# EAGLE schematic 32u4 denemesi (EAGLE 7.4.0)
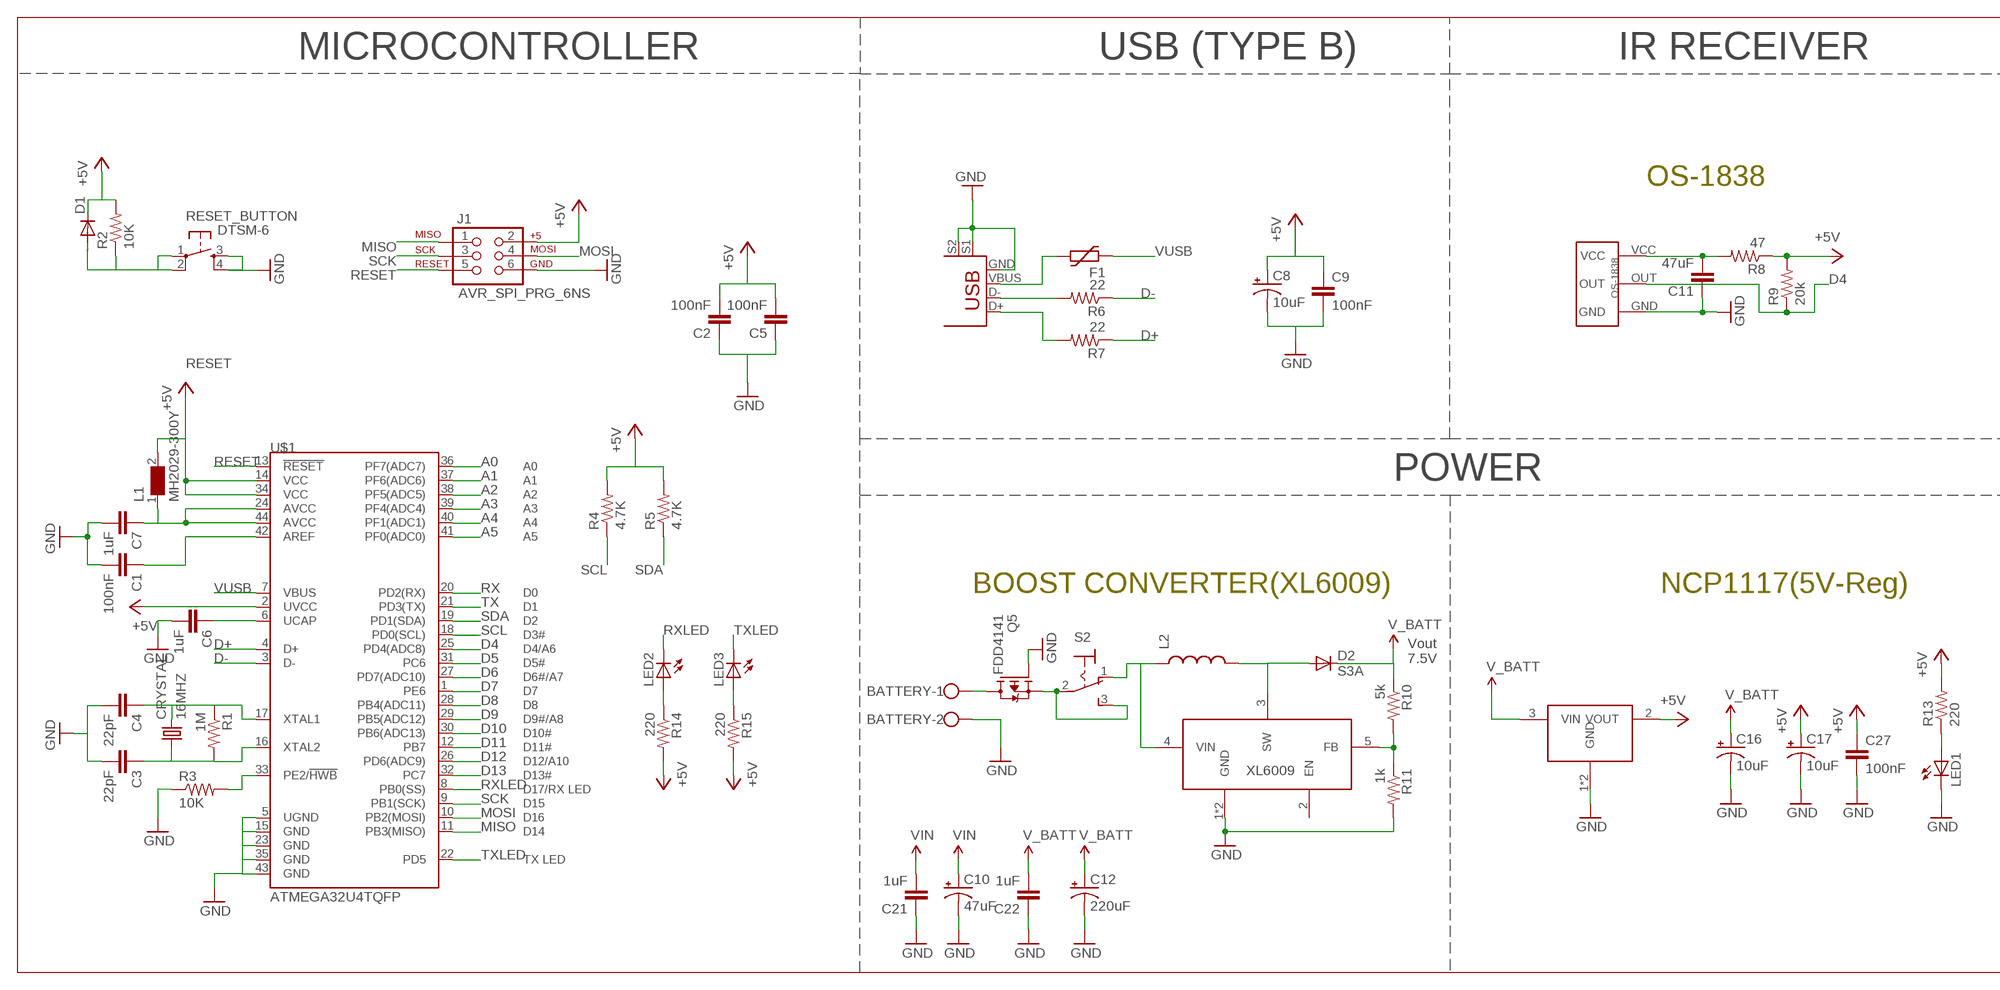
[diagram p0: schematic, sheet 1, part 1 of 2]
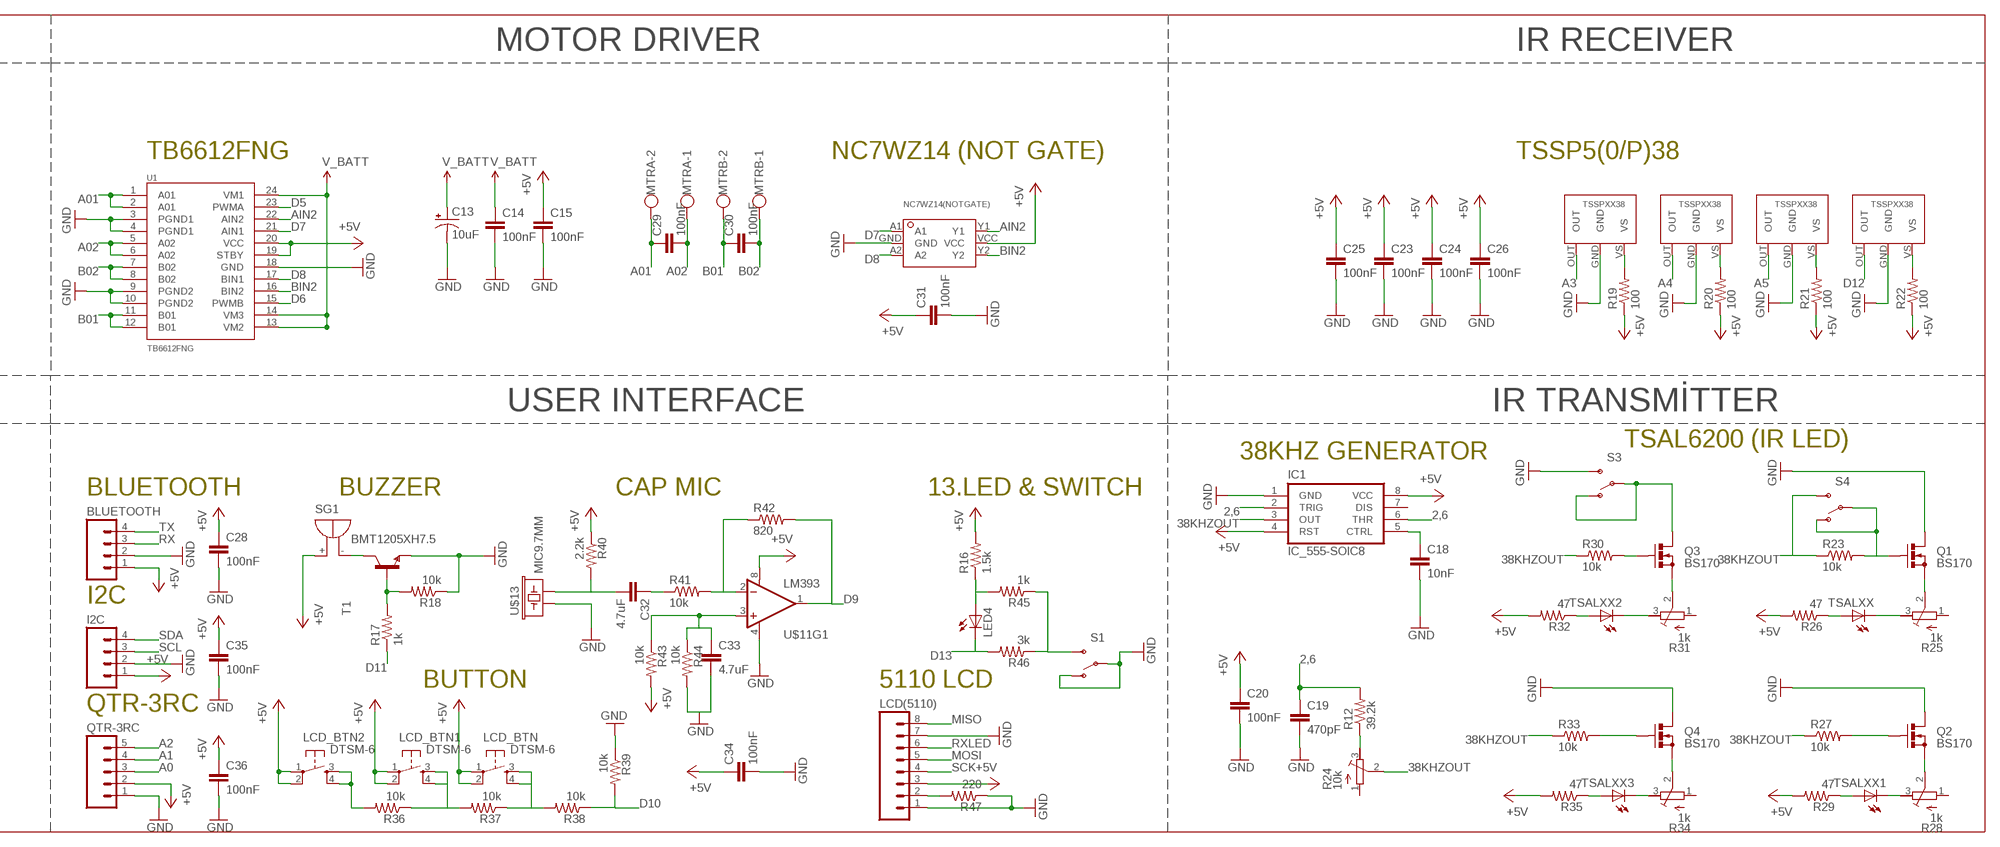
[diagram p1: schematic, sheet 1, part 2 of 2]

## Parts
BATTERY  W237-102  [W237-102]
BLUETOOTH  M04PTH  [1X04]
C1  100nF  CAP0805  [0805]
C2  100nF  CAP0805  [0805]
C3  22pF  CAP0805  [0805]
C4  22pF  CAP0805  [0805]
C5  100nF  CAP0805  [0805]
C6  1uF  CAP1206  [1206]
C7  1uF  CAP1206  [1206]
C8  10uF  CAP_POL1206  [EIA3216]
C9  100nF  CAP0805  [0805]
C10  47uF  CAP_POLF80  [NIPPON_F80]
C11  47uF  CAP1206  [1206]
C12  220uF  CAP_POLG  [PANASONIC_G]
C13  10uF  CAP_POL3528  [EIA3528]
C14  100nF  CAP0805  [0805]
C15  100nF  CAP0805  [0805]
C16  10uF  CAP_POL1206  [EIA3216]
C17  10uF  CAP_POL1206  [EIA3216]
C18  10nF  CAP0805  [0805]
C19  470pF  CAP0805  [0805]
C20  100nF  CAP0805  [0805]
C21  1uF  CAP1206  [1206]
C22  1uF  CAP1206  [1206]
C23  100nF  CAP0805  [0805]
C24  100nF  CAP0805  [0805]
C25  100nF  CAP0805  [0805]
C26  100nF  CAP0805  [0805]
C27  100nF  CAP0805  [0805]
C28  100nF  CAP0805  [0805]
C29  100nF  CAP0805  [0805]
C30  100nF  CAP0805  [0805]
C31  100nF  CAP0805  [0805]
C32  4.7uF  CAP1206  [1206]
C33  4.7uF  CAP1206  [1206]
C34  100nF  CAP0805  [0805]
C35  100nF  CAP0805  [0805]
C36  100nF  CAP0805  [0805]
CRYSTAL  16MHZ  CRYSTAL5X3  [CRYSTAL-SMD-5X3]
D1  DIODE-MINIMELF  [MINIMELF]
D2  S3A  [DO214AB]
F1  FUSE_PTC-0805  [PTC0805]
I2C  M04PTH  [1X04]
IC1  IC_555-SOIC8  [SOIC-8]
J1  AVR_SPI_PRG_6NS  [2X3-NS]
L1  MH2029-300Y  WE-CBF_0805  [0805]
L2  INDUCTORPWR  [CDRH125]
LCD(5110)  M081X08  [1X08]
LCD_BTN  DTSM-6  [DTSM-6]
LCD_BTN1  DTSM-6  [DTSM-6]
LCD_BTN2  DTSM-6  [DTSM-6]
LED1  LEDCHIPLED_0805  [CHIPLED_0805]
LED2  LEDCHIPLED_0805  [CHIPLED_0805]
LED3  LEDCHIPLED_0805  [CHIPLED_0805]
LED4  LEDCHIPLED_0805  [CHIPLED_0805]
MTRA  W237-102  [W237-102]
MTRB  W237-102  [W237-102]
Q1  BS170  [SOT54ES]
Q2  BS170  [SOT54ES]
Q3  BS170  [SOT54ES]
Q4  BS170  [SOT54ES]
Q5  FDD4141  FDD4141TO252  [TO252]
QTR-3RC  M05PTH  [1X05]
R1  1M  RESISTOR0805-RES  [0805]
R2  10K  RESISTOR0805-RES  [0805]
R3  10K  RESISTOR0805-RES  [0805]
R4  4.7K  RESISTOR0805-RES  [0805]
R5  4.7K  RESISTOR0805-RES  [0805]
R6  22  RESISTOR0805-RES  [0805]
R7  22  RESISTOR0805-RES  [0805]
R8  47  RESISTOR0805-RES  [0805]
R9  20k  RESISTOR0805-RES  [0805]
R10  5k  RESISTOR0805-RES  [0805]
R11  1k  RESISTOR0805-RES  [0805]
R12  39.2k  RESISTOR0402-RES  [0402-RES]
R13  220  RESISTOR0805-RES  [0805]
R14  220  RESISTOR0805-RES  [0805]
R15  220  RESISTOR0805-RES  [0805]
R16  1.5k  RESISTOR0805-RES  [0805]
R17  1k  RESISTOR0805-RES  [0805]
R18  10k  RESISTOR0805-RES  [0805]
R19  100  RESISTOR0805-RES  [0805]
R20  100  RESISTOR0805-RES  [0805]
R21  100  RESISTOR0805-RES  [0805]
R22  100  RESISTOR0805-RES  [0805]
R23  10k  RESISTOR0402-RES  [0402-RES]
R24  10k  R-TRIMM3296W  [RTRIM3296W]
R25  1k  R-TRIMM3296W  [RTRIM3296W]
R26  47  RESISTOR0402-RES  [0402-RES]
R27  10k  RESISTOR0402-RES  [0402-RES]
R28  1k  R-TRIMM3296W  [RTRIM3296W]
R29  47  RESISTOR0402-RES  [0402-RES]
R30  10k  RESISTOR0402-RES  [0402-RES]
R31  1k  R-TRIMM3296W  [RTRIM3296W]
R32  47  RESISTOR0402-RES  [0402-RES]
R33  10k  RESISTOR0402-RES  [0402-RES]
R34  1k  R-TRIMM3296W  [RTRIM3296W]
R35  47  RESISTOR0402-RES  [0402-RES]
R36  10k  RESISTOR0805-RES  [0805]
R37  10k  RESISTOR0805-RES  [0805]
R38  10k  RESISTOR0805-RES  [0805]
R39  10k  RESISTOR0805-RES  [0805]
R40  2.2k  RESISTOR0805-RES  [0805]
R41  10k  RESISTOR0805-RES  [0805]
R42  820  RESISTOR0805-RES  [0805]
R43  10k  RESISTOR0805-RES  [0805]
R44  10k  RESISTOR0805-RES  [0805]
R45  1k  RESISTOR0805-RES  [0805]
R46  3k  RESISTOR0805-RES  [0805]
R47  220  RESISTOR0805-RES  [0805]
RESET_BUTTON  DTSM-6  [DTSM-6]
S1  SWITCH-SPDTPTH  [SWITCH-SPDT]
S2  M9040P  [M9040P]
S3  SWITCH-SPDTPTH  [SWITCH-SPDT]
S4  SWITCH-SPDTPTH  [SWITCH-SPDT]
SG1  BMT1205XH7.5  [BMT1205XH7.5]
T1  MMBT2222ALT1-NPN-SOT23-BEC  [SOT23-BEC]
TSALXX  LED5MM  [LED5MM]
TSALXX1  LED5MM  [LED5MM]
TSALXX2  LED5MM  [LED5MM]
TSALXX3  LED5MM  [LED5MM]
U1  TB6612FNG  TB6621FNG  [SSOP24]
U$1  ATMEGA32U4TQFP  [SPARKFUN-DIGITALIC_TQFP44]
U$2  USB+SHIELD  [USB-B-PTH]
U$3  OS-1838  [OS-1838]
U$4  TO263-5L  [TO263-51]
U$5  NCP1117  [SOT223]
U$6  TSSPXX38  [TSSPXX38]
U$7  TSSPXX38  [TSSPXX38]
U$8  TSSPXX38  [TSSPXX38]
U$9  TSSPXX38  [TSSPXX38]
U$10  NC7WZ14(NOTGATE)  [SC-70-6]
U$11  LM393  [SO08]
U$13  MIC9.7MM  [MIC-9.7MM]

## Nets
2,6: C19.1 IC1.2(TRIG) IC1.6(THR) R12.2
38KHZOUT: IC1.3(OUT) R23.1 R24.2(S) R27.1 R30.1 R33.1 S4.3(S)
+5V: BLUETOOTH.1 C2.2 C5.2 C8.A(+) C9.1 C15.1 C17.A(+) C20.1 C23.1 C24.1 C25.1 C26.1 C27.1 C28.1 C31.1 C34.1 C35.1 C36.1 D1.C I2C.1 IC1.4(RST) IC1.8(VCC) J1.2 L1.2 LCD(5110).3 LCD_BTN1.1 LCD_BTN1.2 LCD_BTN2.1 LCD_BTN2.2 LCD_BTN.1 LCD_BTN.2 QTR-3RC.2 R2.2 R4.2 R5.2 R8.1 R9.2 R13.2 R14.2 R15.2 R16.2 R19.1 R20.1 R21.1 R22.1 R26.2 R29.2 R32.2 R35.2 R40.1 R43.2 SG1.+ U1.19(STBY) U1.20(VCC) U$1.2(UVCC) U$1.14(VCC) U$1.34(VCC) U$5.2(VOUT) U$10.VCC U$11.8(V+)
A0: QTR-3RC.3 U$1.36(PF7(ADC7))
A1: QTR-3RC.4 U$1.37(PF6(ADC6))
A01: C29.1 MTRA.2 U1.1(A01) U1.2(A01)
A2: QTR-3RC.5 U$1.38(PF5(ADC5))
A02: C29.2 MTRA.1 U1.5(A02) U1.6(A02)
A3: U$1.39(PF4(ADC4)) U$9.OUT
A4: U$1.40(PF1(ADC1)) U$8.OUT
A5: U$1.41(PF0(ADC0)) U$7.OUT
AIN2: U1.22(AIN2) U$10.Y1
B01: C30.1 MTRB.2 U1.11(B01) U1.12(B01)
B02: C30.2 MTRB.1 U1.7(B02) U1.8(B02)
BIN2: U1.16(BIN2) U$10.Y2
CTRL: C18.1 IC1.5(CTRL)
D4: R9.1 U$1.25(PD4(ADC8)) U$3.OUT
D5: U1.23(PWMA) U$1.31(PC6)
D6: U1.15(PWMB) U$1.27(PD7(ADC10))
D7: U1.21(AIN1) U$1.1(PE6) U$10.A1
D8: U1.17(BIN1) U$1.28(PB4(ADC11)) U$10.A2
D9: R42.2 U$1.29(PB5(ADC12)) U$11.1(OUT)
D10: R38.1 R39.2 U$1.30(PB6(ADC13))
D11: R17.1 U$1.12(PB7)
D12: U$1.26(PD6(ADC9)) U$6.OUT
D13: LED4.C R46.2 U$1.32(PC7)
D+: R7.1 U$1.4(D+)
D-: R6.1 U$1.3(D-)
GND: BATTERY.2 BLUETOOTH.2 C1.2 C2.1 C3.2 C4.2 C5.1 C6.2 C7.2 C8.C(-) C9.2 C10.- C11.1 C12.- C13.C(-) C14.2 C15.2 C16.C(-) C17.C(-) C18.2 C19.2 C20.2 C21.1 C22.1 C23.2 C24.2 C25.2 C26.2 C27.2 C28.2 C31.2 C33.2 C34.2 C35.2 C36.2 I2C.2 IC1.1(GND) J1.6 LCD(5110).1 LCD(5110).7 LED1.C Q1.D Q2.D Q4.D Q5.1(G) QTR-3RC.1 R3.1 R11.2 R18.1 R39.1 R44.2 R47.1 RESET_BUTTON.3 RESET_BUTTON.4 S1.1(O) S1.2(P) S3.3(S) T1.E U1.3(PGND1) U1.4(PGND1) U1.9(PGND2) U1.10(PGND2) U1.18(GND) U$1.5(UGND) U$1.15(GND) U$1.23(GND) U$1.35(GND) U$1.43(GND) U$2.GND U$2.S1 U$2.S2 U$3.GND U$4.1(GND) U$4.6(GND) U$5.1(GND) U$5.4(GND) U$6.GND U$7.GND U$8.GND U$9.GND U$10.GND U$11.4(V-) U$13.1
MISO: J1.1 LCD(5110).8 U$1.11(PB3(MISO))
MOSI: J1.4 LCD(5110).5 U$1.10(PB2(MOSI))
N$1: C7.1 L1.1 U$1.24(AVCC) U$1.44(AVCC)
N$2: C1.1 U$1.42(AREF)
N$3: C6.1 U$1.6(UCAP)
N$4: C4.1 CRYSTAL.3 R1.1 U$1.17(XTAL1)
N$5: C3.1 CRYSTAL.1 R1.2 U$1.16(XTAL2)
N$6: F1.2 U$2.VBUS
N$7: R3.2 U$1.33(PE2/!HWB)
N$8: LCD_BTN2.3 LCD_BTN2.4 R36.2
N$9: R6.2 U$2.D-
N$10: R7.2 U$2.D+
N$11: R19.2 U$9.VS
N$12: C11.2 R8.2 U$3.VCC
N$13: D2.A L2.2 U$4.3(SW)
N$14: LED1.A R13.1
N$15: R10.2 R11.1 U$4.5(FB)
N$16: L2.1 S2.1(O) U$4.4(VIN)
N$17: LCD_BTN.3 LCD_BTN.4 R37.1 R38.2
N$18: LCD_BTN1.3 LCD_BTN1.4 R36.1 R37.2
N$19: C32.2 R40.2 U$13.2
N$20: C32.1 R41.1
N$21: R41.2 R42.1 U$11.2(-IN)
N$22: LED2.A R14.1
N$23: LED3.A R15.1
N$24: LED4.A R16.1 R45.2
N$25: R17.2 R18.2 T1.B
N$26: R20.2 U$8.VS
N$27: SG1.- T1.C
N$28: R21.2 U$7.VS
N$29: R12.1 R24.3(A)
N$30: R22.2 U$6.VS
N$31: Q1.G R23.2 S4.1(O) S4.2(P)
N$32: Q1.S R25.2(S)
N$33: R25.3(A) TSALXX.K(C)
N$34: R26.1 TSALXX.A
N$35: Q2.G R27.2
N$36: Q2.S R28.2(S)
N$37: R28.3(A) TSALXX1.K(C)
N$38: R29.1 TSALXX1.A
N$39: Q3.G R30.2
N$40: Q3.S R31.2(S)
N$41: R31.3(A) TSALXX2.K(C)
N$42: R32.1 TSALXX2.A
N$43: Q4.G R33.2
N$44: Q4.S R34.2(S)
N$45: R34.3(A) TSALXX3.K(C)
N$46: R35.1 TSALXX3.A
N$47: BATTERY.1 Q5.3(D)
N$48: Q5.2(S) S2.2(P) S2.3(S)
N$49: R45.1 R46.1 S1.3(S)
N$50: C33.1 R43.1 R44.1 U$11.3(+IN)
N$51: Q3.D S3.1(O) S3.2(P)
N$55: LCD(5110).2 R47.2
RESET: D1.A J1.5 R2.1 RESET_BUTTON.1 RESET_BUTTON.2 U$1.13(!RESET)
RX: BLUETOOTH.3 U$1.20(PD2(RX))
RXLED: LCD(5110).6 LED2.C U$1.8(PB0(SS))
SCK: J1.3 LCD(5110).4 U$1.9(PB1(SCK))
SCL: I2C.3 R4.1 U$1.18(PD0(SCL))
SDA: I2C.4 R5.1 U$1.19(PD1(SDA))
TX: BLUETOOTH.4 U$1.21(PD3(TX))
TXLED: LED3.C U$1.22(PD5)
V_BATT: C12.+ C13.A(+) C14.1 C16.A(+) C22.2 D2.C R10.1 U1.13(VM2) U1.14(VM3) U1.24(VM1) U$5.3(VIN)
VIN: C10.+ C21.2
VUSB: F1.1 U$1.7(VBUS)
Unconnected: IC1.7(DIS) R24.1(E) R25.1(E) R28.1(E) R31.1(E) R34.1(E) U$4.2(EN) U$11.5(+IN) U$11.6(-IN) U$11.7(OUT)

## Notes on the sheet
- MICROCONTROLLER | USB (TYPE B) | IR RECEIVER | MOTOR DRIVER | IR RECEIVER
- OS-1838 | TB6612FNG | NC7WZ14 (NOT GATE) | TSSP5(0/P)38
- POWER | USER INTERFACE | IR TRANSMİTTER
- TSAL6200 (IR LED)
- 38KHZ GENERATOR
- BLUETOOTH | BUZZER | CAP MIC | 13.LED & SWITCH
- BOOST CONVERTER(XL6009) | NCP1117(5V-Reg)
- Vout
  7.5V
- I2C
- BUTTON | 5110 LCD
- QTR-3RC

## Library data of the parts
BATTERY MTRA MTRB = con-wago-500:W237-102: WAGO SCREW CLAMP; MPN: 237-102; OC_FARNELL: unknown; OC_NEWARK: 70K9898
BLUETOOTH I2C = SparkFun-Connectors:M04: Header 4 Standard 4-pin 0.1" header. Use with straight break away headers (SKU : PRT-00116), right angle break away headers (PRT-00553), swiss pins (PRT-00743), machine pins (PRT-00117), and female headers (PRT-00115). Molex polarized connector foot print use with SKU : PRT-08231 with associated crimp pins and housings. 1MM SMD Version SKU: PRT-10208
C1-C7 C9 C11 C14 C15 C18-C36 = SparkFun-Passives:CAP: Capacitor Standard 0603 ceramic capacitor, and 0.1" leaded capacitor.
C8 C13 C16 C17 = SparkFun-Capacitors:CAP_POL: Capacitor Polarized These are standard SMD and PTH capacitors. Normally 10uF, 47uF, and 100uF in electrolytic and tantalum varieties. Always verify the external diameter of the through hole cap, it varies with capacity, voltage, and manufacturer. The EIA devices should be standard.
C10 C12 = SparkFun-Passives:CAP_POL: Capacitor Polarized These are standard SMD and PTH capacitors. Normally 10uF, 47uF, and 100uF in electrolytic and tantalum varieties. Always verify the external diameter of the through hole cap, it varies with capacity, voltage, and manufacturer. The EIA devices should be standard.
CRYSTAL = SparkFun-FreqCtrl:CRYSTAL: Various standard crystals. Proven footprints. Spark Fun Electronics SKU : COM-00534
D1 = diode:DIODE-: DIODE
D2 = s3x_10:S3*: S3A - S3N General Purpose Rectifiers Source: http://www.fairchildsemi.com/datasheets/S3/S3A.pdf; MF: Fairchild; MPN: S3A; OC_FARNELL: 1017803; OC_NEWARK: 58K2395
F1 = dp_devices:FUSE_PTC: Resettable PTC
IC1 = dp_devices:IC_555: Classic 555 IC
J1 = SparkFun-Connectors:AVR_SPI_PRG_6: AVR ISP 6 Pin This is the reduced ISP connector for AVR programming. Common on Arduino. This footprint will take up less PCB space and can be used with a 10-pin to 6-pin adapter such as SKU: BOB-08508
L1 = wuerth_elektronik_v5:WE-CBF: SMD EMI Suppression Ferrite Beads - excellent anti-EMI properties - low DCR - impedances till 3000 ohms - rated current up to 6 A
L2 = SparkFun-Passives:INDUCTOR: Inductors Basic Inductor/Choke - 0603 and 1206. Footprints are not proven and vary greatly between part numbers. SRN6045- 33uH, 20% 1.4A SDR0403-560KL - 56uH, 10%, 500mA RMS/740mA peak
LCD(5110) = SparkFun-Connectors:M08: Header 8 Standard 8-pin 0.1" header. Use with straight break away headers (SKU : PRT-00116), right angle break away headers (PRT-00553), swiss pins (PRT-00743), machine pins (PRT-00117), and female headers (PRT-00115).
LCD_BTN LCD_BTN1 LCD_BTN2 RESET_BUTTON = switch-tact:DTSM-6
LED1-LED4 TSALXX TSALXX1-TSALXX3 = led:LED: LED OSRAM: - CHIPLED LG R971, LG N971, LY N971, LG Q971, LY Q971, LO R971, LY R971 LH N974, LH R974 LS Q976, LO Q976, LY Q976 LO Q996 - Hyper CHIPLED LW Q18S LB Q993, LB Q99A, LB R99A - SideLED LS A670, LO A670, LY A670, LG A670, LP A670 LB A673, LV A673, LT A673, LW A673 LH A674 LY A675 LS A676, LA A676, LO A676, LY A676, LW A676 LS A679, LY A679, LG A679 - Hyper Micro SIDELED® LS Y876, LA Y876, LO Y876, LY Y876 LT Y87S - SmartLED LW L88C, LW L88S LB L89C, LB L89S, LG L890 LS L89K, LO L89K, LY L89K LS L896, LA L896, LO L896, LY L896 - TOPLED LS T670, LO T670, LY T670, LG T670, LP T670 LSG T670, LSP T670, LSY T670, LOP T670, LYG T670 LG T671, LOG T671, LSG T671 LB T673, LV T673, LT T673, LW T673 LH T674 LS T676, LA T676, LO T676, LY T676, LB T676, LH T676, LSB T676, LW T676 LB T67C, LV T67C, LT T67C, LS T67K, LO T67K, LY T67K, LW E67C LS E67B, LA E67B, LO E67B, LY E67B, LB E67C, LV E67C, LT E67C LW T67C LS T679, LY T679, LG T679 LS T770, LO T770, LY T770, LG T770, LP T770 LB T773, LV T773, LT T773, LW T773 LH T774 LS E675, LA E675, LY E675, LS T675 LS T776, LA T776, LO T776, LY T776, LB T776 LHGB T686 LT T68C, LB T68C - Hyper Mini TOPLED® LB M676 - Mini TOPLED Santana® LG M470 LS M47K, LO M47K, LY M47K Source: http://www.osram.convergy.de LUXEON: - LUMILED® LXK2-PW12-R00, LXK2-PW12-S00, LXK2-PW14-U00, LXK2-PW14-V00 LXK2-PM12-R00, LXK2-PM12-S00, LXK2-PM14-U00 LXK2-PE12-Q00, LXK2-PE12-R00, LXK2-PE12-S00, LXK2-PE14-T00, LXK2-PE14-U00 LXK2-PB12-K00, LXK2-PB12-L00, LXK2-PB12-M00, LXK2-PB14-N00, LXK2-PB14-P00, LXK2-PB14-Q00 LXK2-PR12-L00, LXK2-PR12-M00, LXK2-PR14-Q00, LXK2-PR14-R00 LXK2-PD12-Q00, LXK2-PD12-R00, LXK2-PD12-S00 LXK2-PH12-R00, LXK2-PH12-S00 LXK2-PL12-P00, LXK2-PL12-Q00, LXK2-PL12-R00 Source: www.luxeon.com KINGBRIGHT: KA-3528ASYC Source: www.kingbright.com
Q1-Q4 = gm-trans:BS170: N-CHANNEL MOS FET
Q5 = transistor-fet:FDD4141: P-Channel PowerTrench® MOSFET Source: FDD4141.pdf
QTR-3RC = SparkFun-Connectors:M05: Header 5 Standard 5-pin 0.1" header. Use with straight break away headers (SKU : PRT-00116), right angle break away headers (PRT-00553), swiss pins (PRT-00743), machine pins (PRT-00117), and female headers (PRT-00115). Molex polarized connector foot print use with SKU : PRT-08230 with associated crimp pins and housings.
R1-R11 R13-R22 R36-R47 = SparkFun-Resistors:RESISTOR: Resistor Basic schematic elements and footprints for 0603, 1206, and PTH resistors.
R12 R23 R26 R27 R29 R30 R32 R33 R35 = SparkFun-Passives:RESISTOR: Resistor Basic schematic elements and footprints for 0603, 1206, and PTH resistors.
R24 R25 R28 R31 R34 = resistor:R-TRIMM: Trimm resistor
S1 S3 S4 = SparkFun-Electromechanical:SWITCH-SPDT: SPDT Switch Simple slide switch, Spark Fun Electronics SKU : COM-00102 DPDT SMT slide switch, AYZ0202, SWCH-08179
S2 = switch:M9040P: TOGGLE SWITCH Marquardt
SG1 = buzzer:BMT1205XH7.5: MAGNETIC TRANSDUCER Source: Http:www.be-star.com; OC_FARNELL: unknown; OC_NEWARK: unknown
T1 = transistor:*-NPN-: NPN Transistror BF959 corrected 2008.03.06
U1 = SparkFun-PowerIC:TB6621FNG: Toshiba 1A dual motor driver IC-09363; PROD_ID: IC-09363
U$1 = SparkFun-DigitalIC:ATMEGA32U4: Atmel 44-pin 8-bit Microcontroller with 32KBytes of ISP Flash and USB Controller ----- Please use the QFN-44-NOPAD_1:1 package for the footprint of all boards using a 32U4. Route traces directly away from the pads as much as possible.; PROD_ID: IC-11161
U$2 = SparkFun-Connectors:USB+SHIELD: USB+Shield USB connector with shield pins connectable
U$3 = HACIBİDEAS:OS-1838
U$4 = m-pad-2.1:TO263-5L
U$5 = SparkFun-PowerIC:NCP1117
U$6-U$9 = HACIBİDEAS:TSSPXX38
U$10 = m-pad-2.1:NC7WZ14(NOTGATE)
U$11 = SparkFun-AnalogIC:LM393: Low-voltage comparator
U$13 = SparkFun-Sensors:MIC: Omni-directional electret microphone. 9.7mm standard diameter.; PROD_ID: COMP-08856